# Altium schematic sheet Powerboard_Conector_2.SchDoc
size A4; CompanyName: Technische Hochschule Nürnberg Georg Simon Ohm; Organization: UltraZohm; Address1: Kesslerplatz 12; Address2: 90489 Nürnberg; Address3: GERMANY; DocumentNumber: 6; SheetNumber: 6; SheetTotal: 6; Website: www.ultrazohm.com
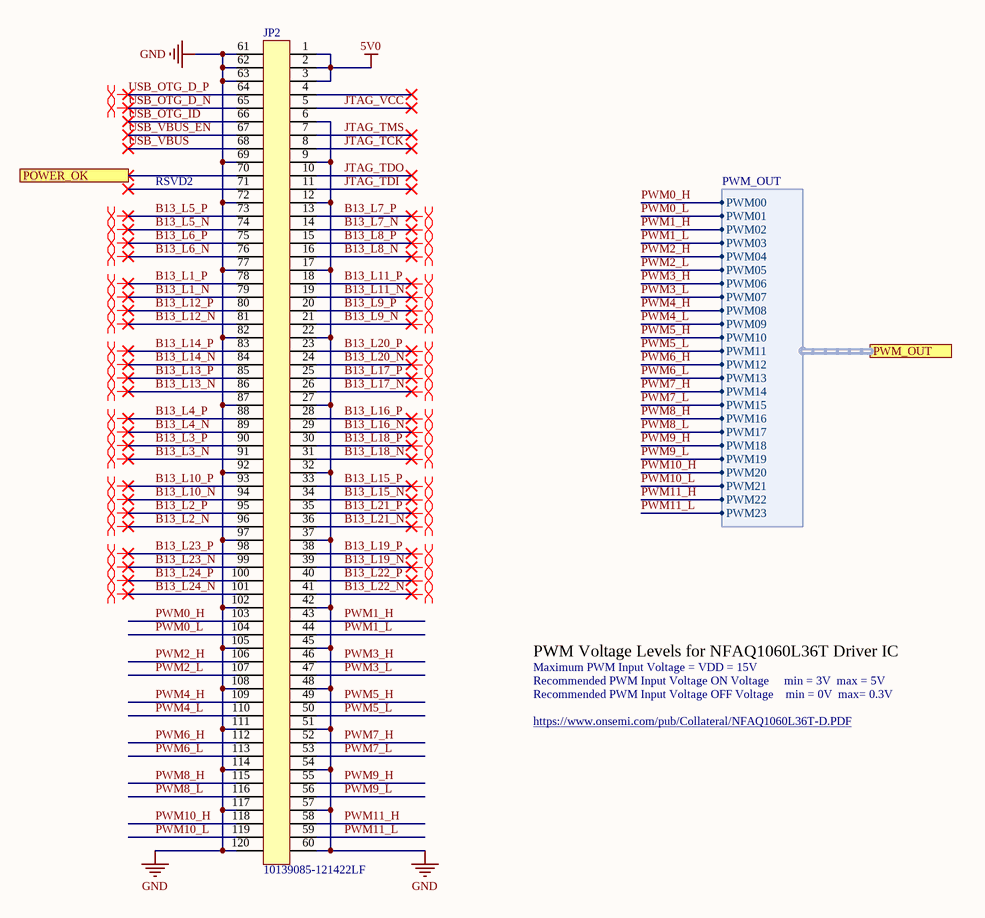
[diagram p0: Powerboard_Conector_2.SchDoc]

## Parts
JP2  10139085-121422LF  [10139085-121422LF]

## Ports
POWER_OK, PWM_OUT (harness PWM_OUT)

## Harnesses
PWM_OUT: PWM00, PWM01, PWM02, PWM03, PWM04, PWM05, PWM06, PWM07, PWM08, PWM09, PWM10, PWM11, PWM12, PWM13, PWM14, PWM15, PWM16, PWM17, PWM18, PWM19, PWM20, PWM21, PWM22, PWM23

## Nets
5V0: JP2.1 JP2.2 JP2.3
GND: JP2.6 JP2.9 JP2.12 JP2.17 JP2.22 JP2.27 JP2.32 JP2.37 JP2.42 JP2.45 JP2.48 JP2.51 JP2.54 JP2.57 JP2.60 JP2.61 JP2.62 JP2.63 JP2.69 JP2.72 JP2.77 JP2.82 JP2.87 JP2.92 JP2.97 JP2.102 JP2.105 JP2.108 JP2.111 JP2.114 JP2.117 JP2.120
B13_L1_N: JP2.79
B13_L1_P: JP2.78
B13_L2_N: JP2.96
B13_L2_P: JP2.95
B13_L3_N: JP2.91
B13_L3_P: JP2.90
B13_L4_N: JP2.89
B13_L4_P: JP2.88
B13_L5_N: JP2.74
B13_L5_P: JP2.73
B13_L6_N: JP2.76
B13_L6_P: JP2.75
B13_L7_N: JP2.14
B13_L7_P: JP2.13
B13_L8_N: JP2.16
B13_L8_P: JP2.15
B13_L9_N: JP2.21
B13_L9_P: JP2.20
B13_L10_N: JP2.94
B13_L10_P: JP2.93
B13_L11_N: JP2.19
B13_L11_P: JP2.18
B13_L12_N: JP2.81
B13_L12_P: JP2.80
B13_L13_N: JP2.86
B13_L13_P: JP2.85
B13_L14_N: JP2.84
B13_L14_P: JP2.83
B13_L15_N: JP2.34
B13_L15_P: JP2.33
B13_L16_N: JP2.29
B13_L16_P: JP2.28
B13_L17_N: JP2.26
B13_L17_P: JP2.25
B13_L18_N: JP2.31
B13_L18_P: JP2.30
B13_L19_N: JP2.39
B13_L19_P: JP2.38
B13_L20_N: JP2.24
B13_L20_P: JP2.23
B13_L21_N: JP2.36
B13_L21_P: JP2.35
B13_L22_N: JP2.41
B13_L22_P: JP2.40
B13_L23_N: JP2.99
B13_L23_P: JP2.98
B13_L24_N: JP2.101
B13_L24_P: JP2.100
JTAG_TCK: JP2.8
JTAG_TDI: JP2.11
JTAG_TDO: JP2.10
JTAG_TMS: JP2.7
JTAG_VCC: JP2.5
POWER_OK: JP2.70 ; port POWER_OK
PWM0_H: JP2.103 ; port PWM_OUT.PWM00
PWM0_L: JP2.104 ; port PWM_OUT.PWM01
PWM1_H: JP2.43 ; port PWM_OUT.PWM02
PWM1_L: JP2.44 ; port PWM_OUT.PWM03
PWM2_H: JP2.106 ; port PWM_OUT.PWM04
PWM2_L: JP2.107 ; port PWM_OUT.PWM05
PWM3_H: JP2.46 ; port PWM_OUT.PWM06
PWM3_L: JP2.47 ; port PWM_OUT.PWM07
PWM4_H: JP2.109 ; port PWM_OUT.PWM08
PWM4_L: JP2.110 ; port PWM_OUT.PWM09
PWM5_H: JP2.49 ; port PWM_OUT.PWM10
PWM5_L: JP2.50 ; port PWM_OUT.PWM11
PWM6_H: JP2.112 ; port PWM_OUT.PWM12
PWM6_L: JP2.113 ; port PWM_OUT.PWM13
PWM7_H: JP2.52 ; port PWM_OUT.PWM14
PWM7_L: JP2.53 ; port PWM_OUT.PWM15
PWM8_H: JP2.115 ; port PWM_OUT.PWM16
PWM8_L: JP2.116 ; port PWM_OUT.PWM17
PWM9_H: JP2.55 ; port PWM_OUT.PWM18
PWM9_L: JP2.56 ; port PWM_OUT.PWM19
PWM10_H: JP2.118 ; port PWM_OUT.PWM20
PWM10_L: JP2.119 ; port PWM_OUT.PWM21
PWM11_H: JP2.58 ; port PWM_OUT.PWM22
PWM11_L: JP2.59 ; port PWM_OUT.PWM23
USB_OTG_D_N: JP2.65
USB_OTG_D_P: JP2.64
USB_OTG_ID: JP2.66
USB_VBUS: JP2.68
USB_VBUS_EN: JP2.67

Not connected (* = marked no-connect by the designer): JP2 4* 71*

## Layout directives
differential pair: B13_L1_N, B13_L1_P, B13_L2_N, B13_L2_P, B13_L3_N, B13_L3_P, B13_L4_N, B13_L4_P, B13_L5_N, B13_L5_P, B13_L6_N, B13_L6_P, B13_L7_N, B13_L7_P, B13_L8_N, B13_L8_P, B13_L9_N, B13_L9_P, B13_L10_N, B13_L10_P, B13_L11_N, B13_L11_P, B13_L12_N, B13_L12_P, B13_L13_N, B13_L13_P, B13_L14_N, B13_L14_P, B13_L15_N, B13_L15_P, B13_L16_N, B13_L16_P, B13_L17_N, B13_L17_P, B13_L18_N, B13_L18_P, B13_L19_N, B13_L19_P, B13_L20_N, B13_L20_P, B13_L21_N, B13_L21_P, B13_L22_N, B13_L22_P, B13_L23_N, B13_L23_P, B13_L24_N, B13_L24_P, USB_OTG_D_N, USB_OTG_D_P

## Notes on the sheet
- RSVD2
- PWM Voltage Levels for NFAQ1060L36T Driver IC
- Maximum PWM Input Voltage = VDD = 15V
- Recommended PWM Input Voltage OFF Voltage    min = 0V  max= 0.3V
- Recommended PWM Input Voltage ON Voltage     min = 3V  max = 5V
- https://www.onsemi.com/pub/Collateral/NFAQ1060L36T-D.PDF
- Title
- Revision:
- Design Engineer:
- Date:
- Project:
- Sheet
- of

## Library data of the parts
JP2 = 10139085-121422LF: Bergstack+ 0.8mm pich - 120pin B2B connector; ComponentLink1Description: Webpage; ComponentLink1URL: https://www.amphenol-icc.com/product-series/bergstak-plus-080mm-mezzanine.html; ComponentLink2Description: Datasheet; ComponentLink2URL: https://cdn.amphenol-icc.com/media/wysiwyg/files/documentation/datasheet/boardwiretoboard/bwb_bergstakplus_080mm_mezzanine.pdf; ComponentLink3Description: Component Drawing; ComponentLink3URL: https://cdn.amphenol-icc.com/media/wysiwyg/files/drawing/10139085.pdf; Part Number: 10139085-121422LF; Publisher: Amphenol ICC